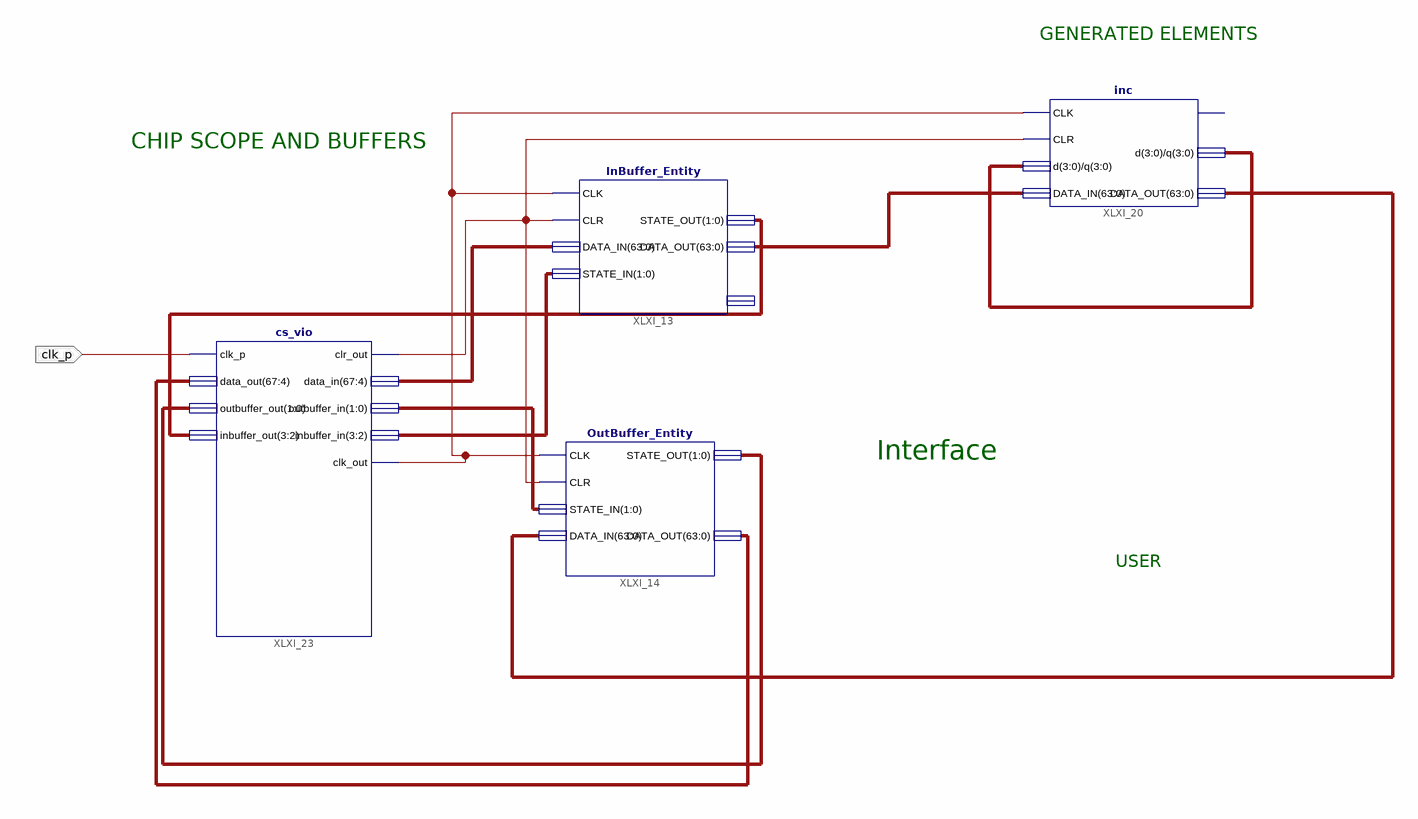
[diagram p0: schematic sheet 1]
// Xilinx ISE schematic top5.sch (spartan6) as structural Verilog: 4 symbols, 1 ports
module top5 (
  input  clk_p
);

  wire XLXN_75, XLXN_77;
  wire [1:0] XLXN_46, XLXN_49;
  wire [3:0] XLXN_72;
  wire [3:2] XLXN_45, XLXN_48;
  wire [63:0] XLXN_70, XLXN_71;
  wire [67:4] XLXN_44, XLXN_47;

  InBuffer_Entity XLXI_13 (
    .CLK(XLXN_77), .CLR(XLXN_75), .STATE_IN(XLXN_45), .DATA_IN(XLXN_44), .STATE_OUT(XLXN_48),
    .DATA_OUT(XLXN_70));  // open: state_buffer_in
  OutBuffer_Entity XLXI_14 (
    .CLK(XLXN_77), .CLR(XLXN_75), .STATE_IN(XLXN_46), .DATA_IN(XLXN_71), .STATE_OUT(XLXN_49),
    .DATA_OUT(XLXN_47));  // open: state_buf_out
  inc XLXI_20 (
    .CLK(XLXN_77), .CLR(XLXN_75), .d(XLXN_72), .DATA_IN(XLXN_70), .q(XLXN_72), .DATA_OUT(XLXN_71));  // open: CLR_O
  cs_vio XLXI_23 (
    .clk_p(clk_p), .data_out(XLXN_47), .outbuffer_out(XLXN_49), .inbuffer_out(XLXN_48), .clr_out(XLXN_75),
    .clk_out(XLXN_77), .data_in(XLXN_44), .outbuffer_in(XLXN_46), .inbuffer_in(XLXN_45));

  // Notes on the sheet:
  //   GENERATED ELEMENTS
  //   CHIP SCOPE AND BUFFERS
  //   Interface
  //   USER
endmodule
